# EAGLE design untitled (EAGLE 7.2.0)
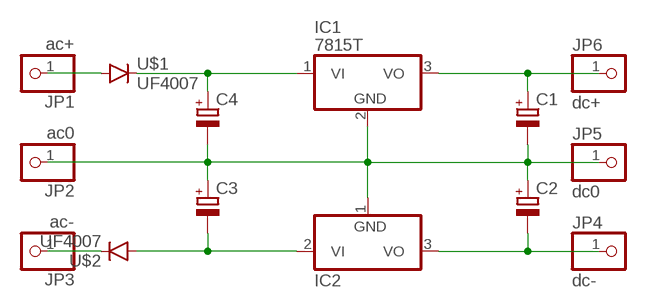
[diagram p0: schematic, sheet 1]

## Parts
C1  CPOL-EUE5-10.5  [E5-10,5]
C2  CPOL-EUE5-10.5  [E5-10,5]
C3  CPOL-EUE5-10.5  [E5-10,5]
C4  CPOL-EUE5-10.5  [E5-10,5]
IC1  7815T  [TO220H]
IC2  7915T  [TO220H]
JP1  ac+  PINHD-1X1  [1X01]
JP2  ac0  PINHD-1X1  [1X01]
JP3  ac-  PINHD-1X1  [1X01]
JP4  dc-  PINHD-1X1  [1X01]
JP5  dc0  PINHD-1X1  [1X01]
JP6  dc+  PINHD-1X1  [1X01]
U$1  UF4007  [SMA-DIODE]
U$2  UF4007  [SMA-DIODE]

## Nets
N$1: C1.- C2.+ C3.+ C4.- IC1.2(GND) IC2.1(GND) JP2.1 JP5.1
N$2: C1.+ IC1.3(VO) JP6.1
N$3: C2.- IC2.3(VO) JP4.1
N$4: C4.+ IC1.1(VI) U$1.C
N$5: C3.- IC2.2(VI) U$2.A
N$7: JP1.1 U$1.A
N$8: JP3.1 U$2.C

## Library data of the parts
C1-C4 = rcl:CPOL-EU: POLARIZED CAPACITOR, European symbol
IC1 = linear:78*: Positive VOLTAGE REGULATOR Source: http://cache.national.com/ds/LM/LM78L05.pdf http://www.fairchildsemi.com/ds/LM/LM7805.pdf
IC2 = linear:79*: Negative VOLTAGE REGULATOR
JP1-JP6 = pinhead:PINHD-1X1: PIN HEADER
U$1 U$2 = DIODE:UF4007

## Board
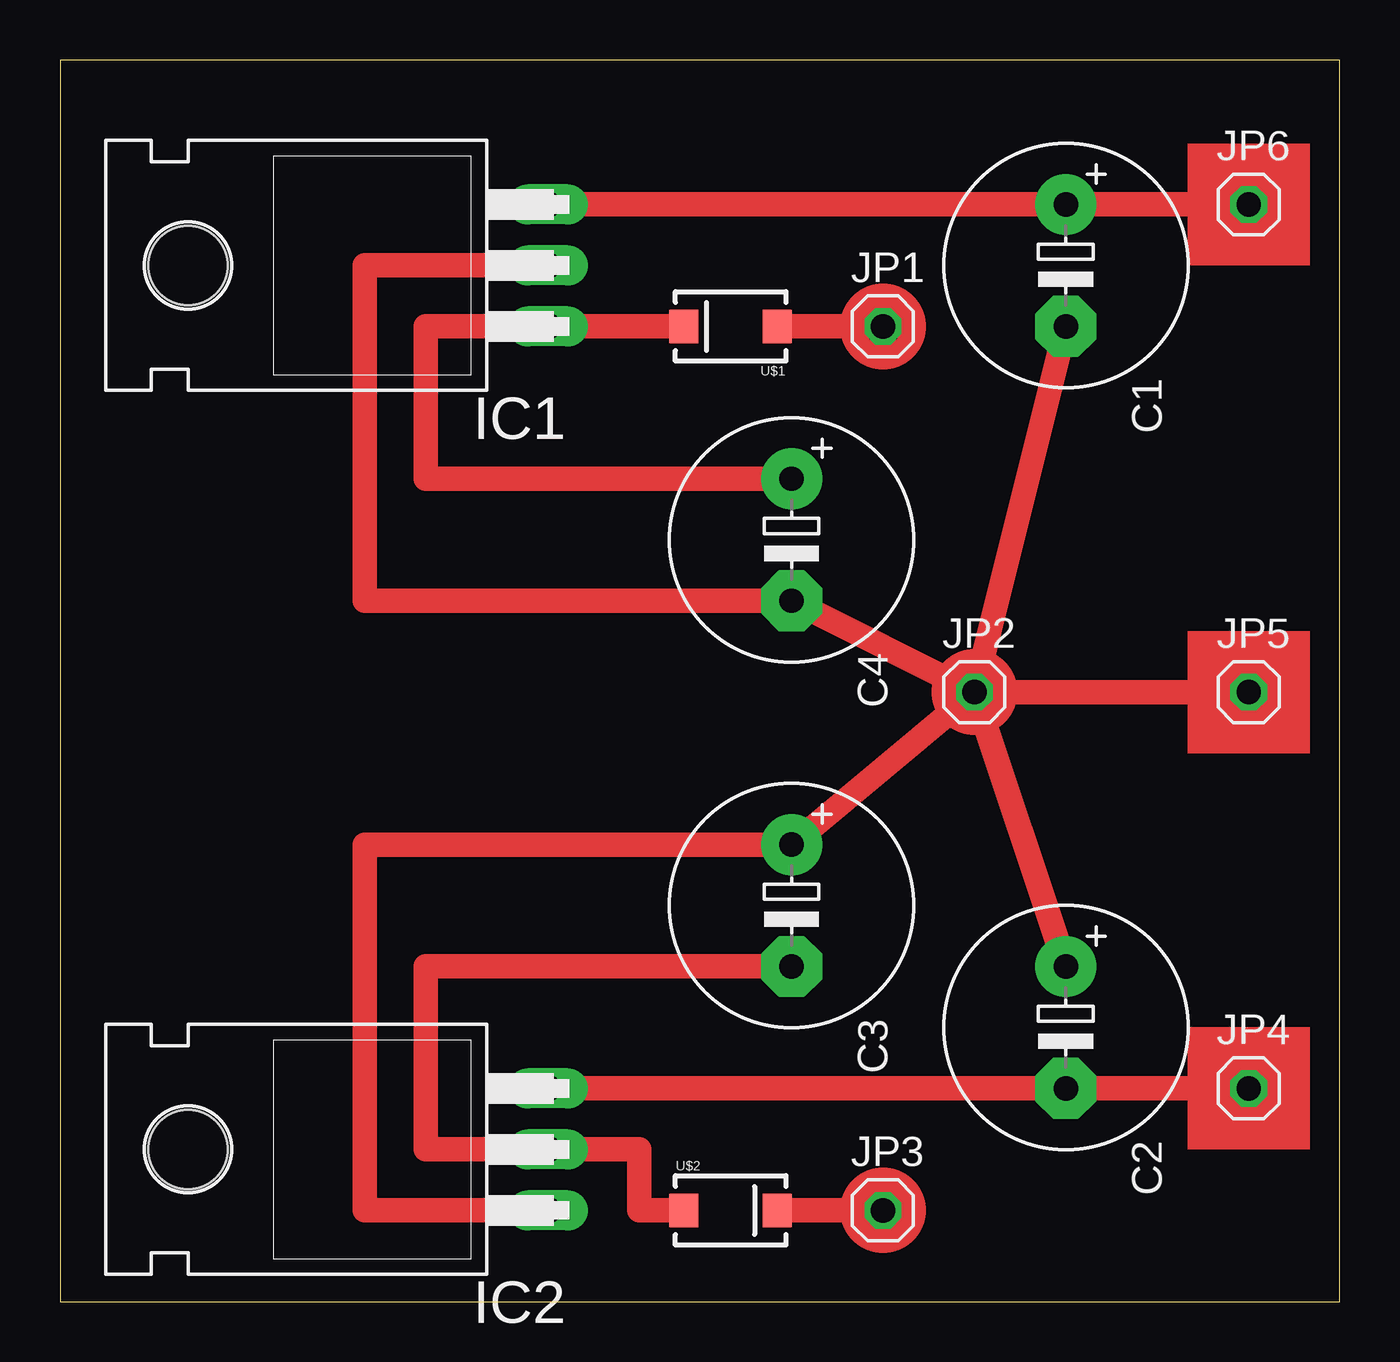
[diagram p1: board, top side]

Size 53.32 x 51.74 mm. Coordinates in mm from the lower left corner, seen from the top.
Outline: 0,0 53.32,0 53.32,51.74 0,51.74 0,0
Copper layers (1*16): Top 0.035mm / dielectric 1.5mm / Bottom 0.035mm
Design rules "default": minimum track width 10mil, minimum drill 24mil, track to track 8mil, track to pad 8mil, pad to pad 8mil, via to via 8mil, smd to smd 8mil, copper to edge 40mil, drill to drill 8mil, minimum pad ring 10mil, minimum via ring 8mil, stop-mask expansion 4mil, vias tented up to drill 0mil, thermal gap 10mil

### Footprints (pad centres in the part's own frame; a part is rotated, then mirrored left to right if it is on the bottom)
E5-10,5 = drill 1.016 pad 2.54: + -2.54,0 | drill 1.016 pad 2.54 octagon: - 2.54,0
TO220H = drill 1.118 long: 1 -2.54,-10.16; 2 0,-10.16; 3 2.54,-10.16 | hole 3.302: 0,4.826
1X01 = drill 1.016 octagon: 1 0,0
SMA-DIODE = smd 1.2 x 1.4: A -1.95,0; C 1.95,0

### Placement (x,y rotation side)
C1  41.91,43.18 270 top
C2  41.91,11.43 270 top
C3  30.48,16.51 270 top
C4  30.48,31.75 270 top
IC1  10.16,43.18 90 top
IC2  10.16,6.35 90 top
JP1  34.29,40.64 0 top
JP2  38.1,25.4 0 top
JP3  34.29,3.81 0 top
JP4  49.53,8.89 0 top
JP5  49.53,25.4 0 top
JP6  49.53,45.72 0 top
U$1  27.94,40.64 180 top
U$2  27.94,3.81 0 top

### Tracks (layer width: path | path; a pad name or v marks a point on that pad's centre or on a via)
N$1
  Top 1.016: IC2.1 12.7,3.81 12.7,19.05 C3.+ JP2.1 | C2.+ JP2.1 | JP5.1 JP2.1 | JP2.1 C4.- 12.7,29.21 12.7,43.18 IC1.2 | C1.- JP2.1
N$2
  Top 1.016: IC1.3 C1.+ JP6.1
N$3
  Top 1.016: IC2.3 C2.- JP4.1
N$4
  Top 1.016: U$1.C IC1.1 15.24,40.64 15.24,34.29 C4.+
N$5
  Top 1.016: U$2.A 24.13,3.81 24.13,6.35 IC2.2 15.24,6.35 15.24,13.97 C3.-
N$7
  Top 1.016: U$1.A JP1.1
N$8
  Top 1.016: JP3.1 U$2.C
(copper drawn outside any net)
  shapes: Top area x3, Top circle x3